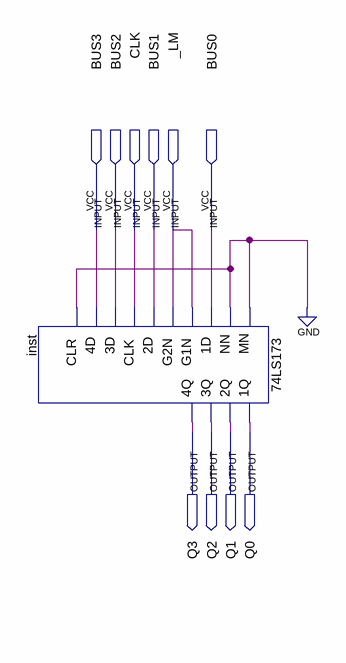
[diagram p0: schematic sheet]
// Quartus schematic RegistradorDeInstrucoes.bdf as structural Verilog: 1 symbols, 10 pins
module RegistradorDeInstrucoes (
  input  BUS3,
  input  BUS2,
  input  CLK,
  input  BUS1,
  input  _LM,
  input  BUS0,
  output Q3,
  output Q2,
  output Q1,
  output Q0
);

  \74LS173  inst (
    .MN(1'b0), .NN(1'b0), .\1D (BUS0), .G1N(_LM), .G2N(_LM), .\2D (BUS1), .CLK(CLK), .\3D (BUS2),
    .\4D (BUS3), .CLR(1'b0), .\1Q (Q0), .\2Q (Q1), .\3Q (Q2), .\4Q (Q3));
endmodule
